# EAGLE design encoder (EAGLE 8.6.0)
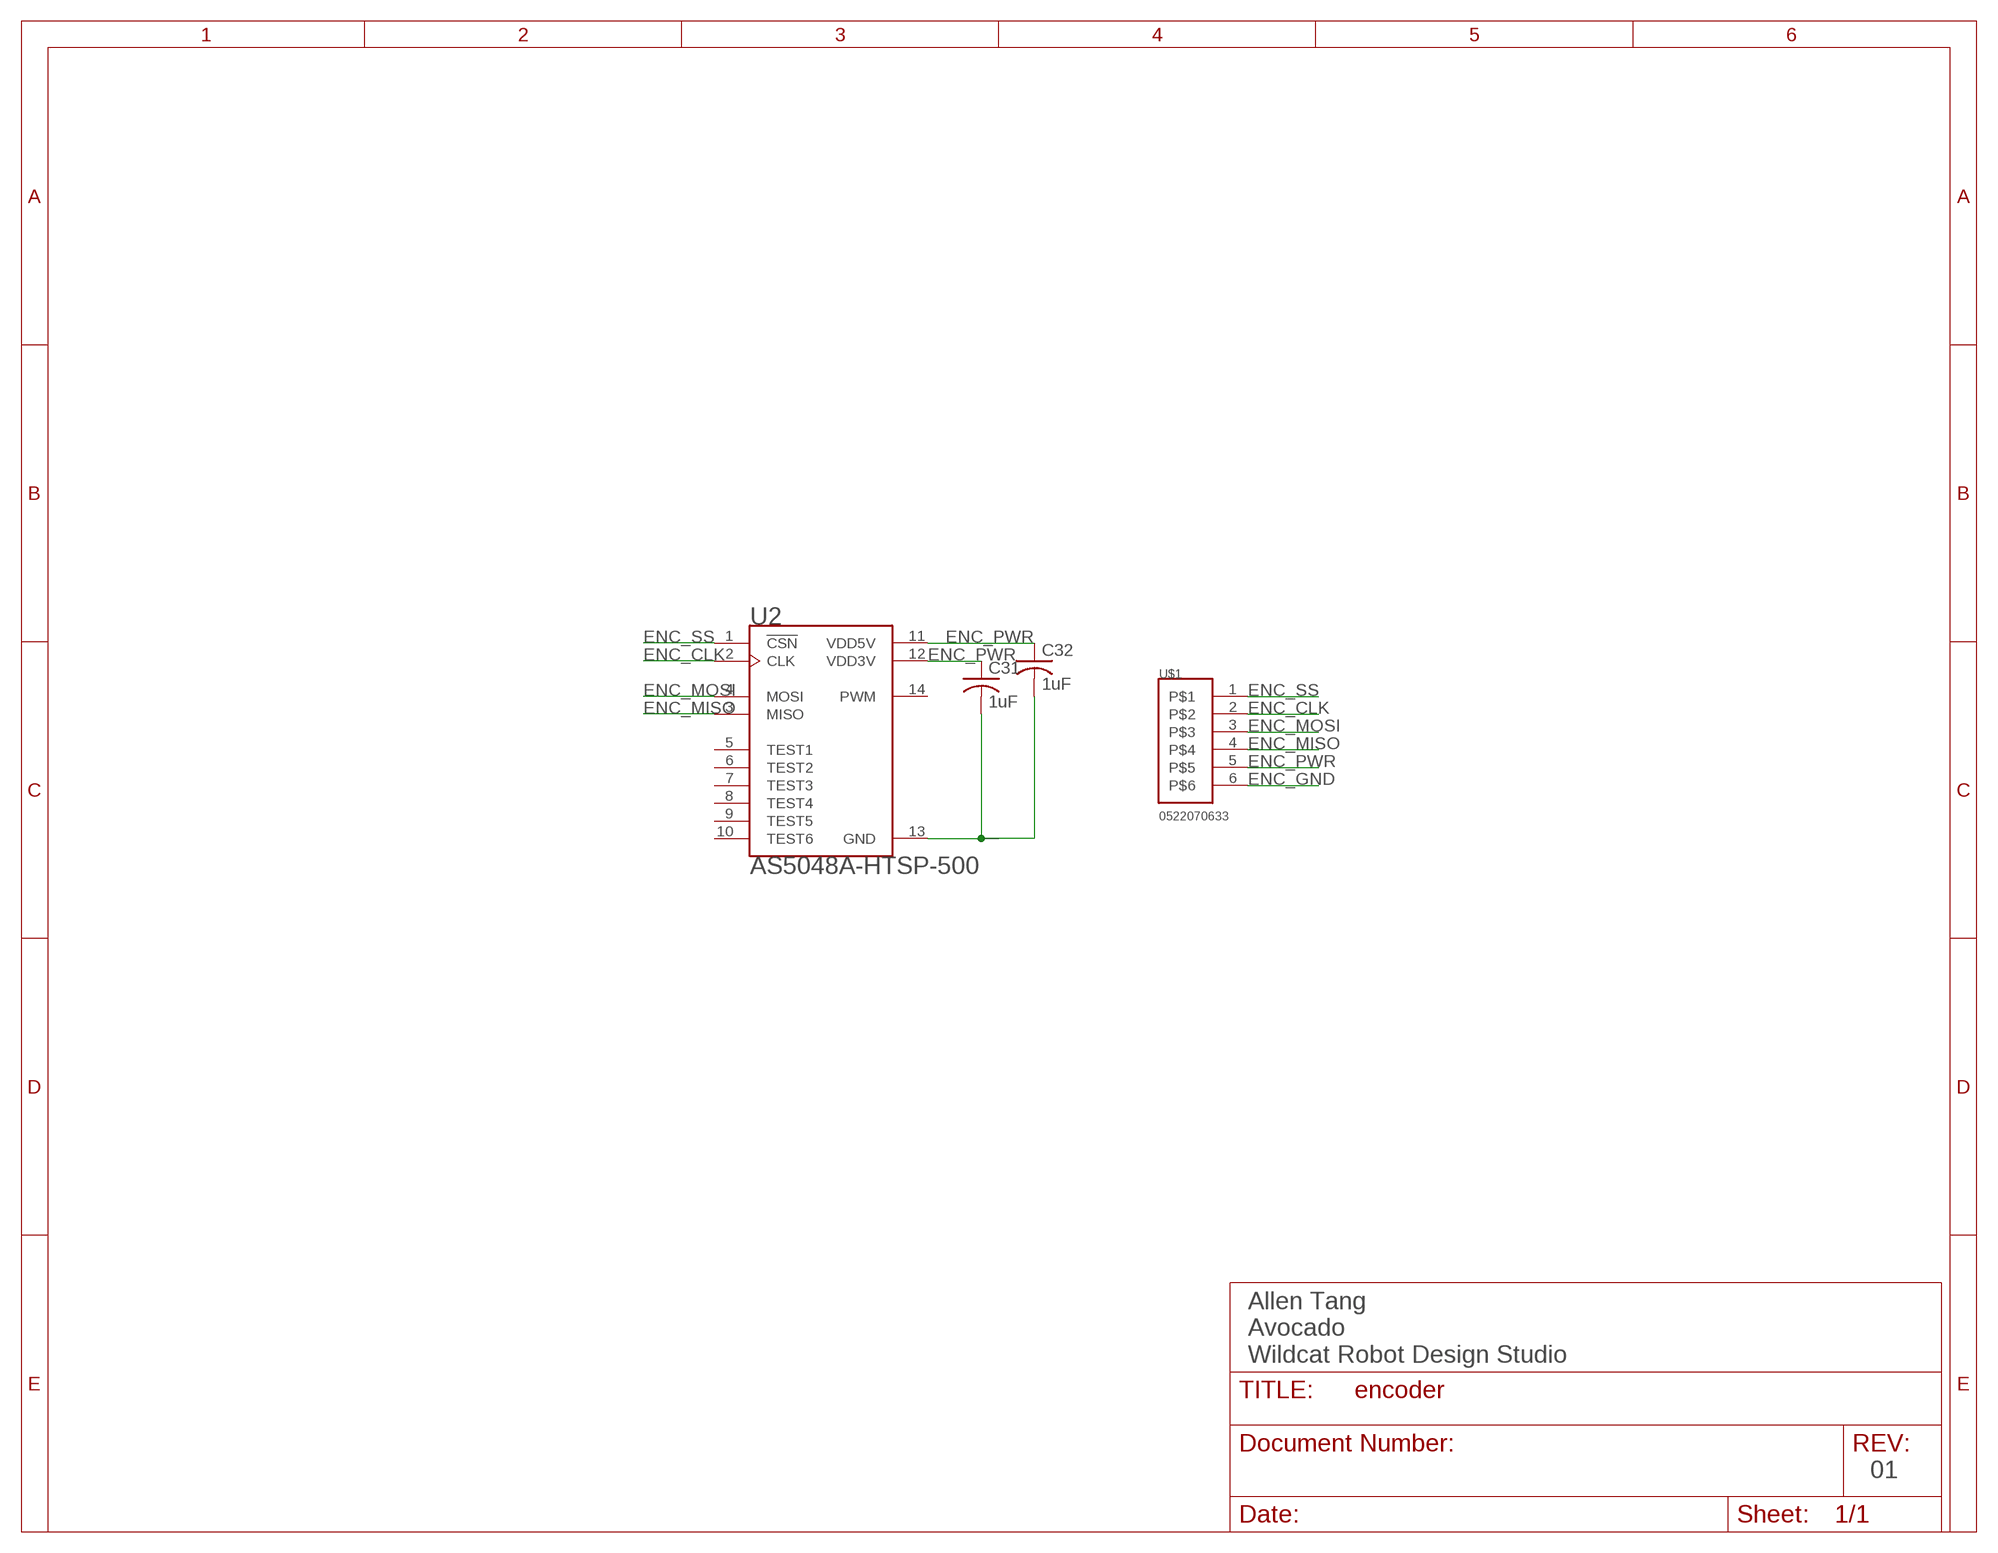
[diagram p0: schematic, sheet 1]

## Parts
C31  1uF  C-USC0805  [C0805]
C32  1uF  C-USC0805  [C0805]
U2  AS5048A-HTSP-500  [SOP65P640X120-14N]
U$1  0522070633  [1MM-FPC-6PIN]

## Nets
ENC_CLK: U2.2(CLK) U$1.2
ENC_GND: C31.2 C32.2 U2.13(GND) U$1.6
ENC_MISO: U2.3(MISO) U$1.4
ENC_MOSI: U2.4(MOSI) U$1.3
ENC_PWR: C31.1 C32.1 U2.11(VDD5V) U2.12(VDD3V) U$1.5
ENC_SS: U2.1(!CSN) U$1.1
Unconnected: U2.5(TEST1) U2.6(TEST2) U2.7(TEST3) U2.8(TEST4) U2.9(TEST5) U2.10(TEST6) U2.14(PWM)

## Notes on the sheet
- Allen Tang
  Avocado
  Wildcat Robot Design Studio
- 01

## Library data of the parts
C31 C32 = rcl:C-US: CAPACITOR, American symbol; SPICEPREFIX: C
U2 = avocado:AS5048A-HTSP-500: AS5048A Series 360° 3.3 / 5 V 14 bit Magnetic Rotary Encoder - TSSOP-14; AVAILABILITY: Unavailable; DESCRIPTION: AS5048B Series 360° 3.3 / 5 V 14 bit Magnetic Rotary Encoder - TSSOP-14; MF: ams; MP: AS5048A-HTSP-500; PACKAGE: TSSOP-14 ams; PRICE: 7.10 USD
U$1 = avocado:0522070633

## Board
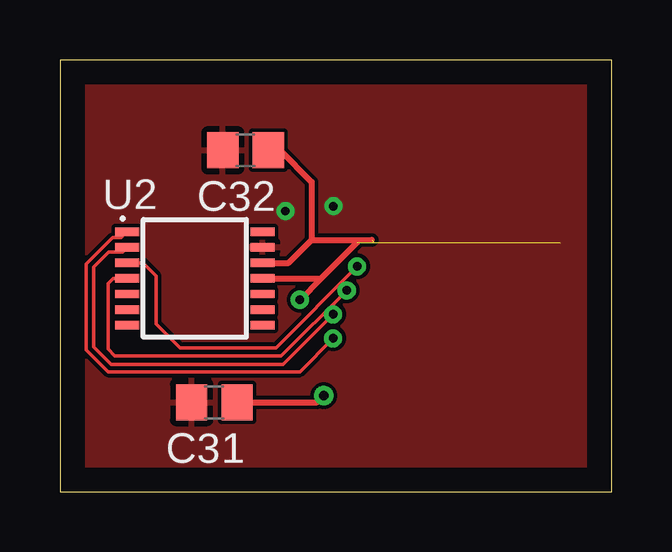
[diagram p1: board, top side]
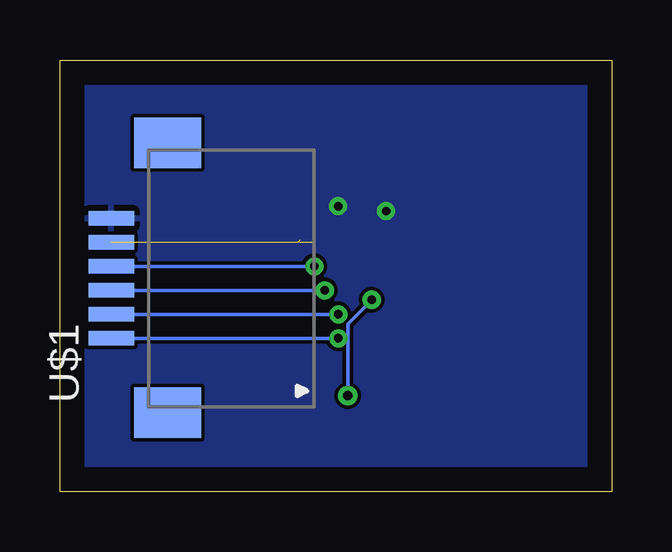
[diagram p2: board, bottom side, seen from below]

Size 23 x 18 mm. Coordinates in mm from the lower left corner, seen from the top.
Outline: 0,0 23,0 23,18 0,18 0,0
Copper layers (1*16): Top 0.035mm / dielectric 1.5mm / Bottom 0.035mm
Design rules "default": minimum track width 6mil, minimum drill 0.35mm, track to track 6mil, track to pad 6mil, pad to pad 6mil, via to via 6mil, smd to smd 6mil, copper to edge 40mil, drill to drill 6mil, minimum pad ring 10mil, minimum via ring 8mil, stop-mask expansion 4mil, vias tented up to drill 0mil, thermal gap 10mil

### Footprints (pad centres in the part's own frame; a part is rotated, then mirrored left to right if it is on the bottom)
C0805 = smd 1.3 x 1.5: 1 -0.95,0; 2 0.95,0
SOP65P640X120-14N = smd 1 x 0.35: 1 -2.825,1.95; 2 -2.825,1.3; 3 -2.825,0.65; 4 -2.825,0; 5 -2.825,-0.65; 6 -2.825,-1.3; 7 -2.825,-1.95; 8 2.825,-1.95; 9 2.825,-1.3; 10 2.825,-0.65; 11 2.825,0; 12 2.825,0.65; 13 2.825,1.3; 14 2.825,1.95
1MM-FPC-6PIN = smd 0.6 x 1.9: 1 -2.5,3.25; 2 -1.5,3.25; 3 -0.5,3.25; 4 0.5,3.25; 5 1.5,3.25; 6 2.5,3.25 | smd 2.1 x 2.8: THERMPAD 5.65,0.9; THERMPAD1 -5.6,0.9

### Placement (x,y rotation side)
C31  6.44,3.72 180 top
C32  7.74,14.23 180 top
U2  5.62,8.89 0 top
U$1  17.61,8.89 90 bottom

### Tracks (layer width: path | path; a pad name or v marks a point on that pad's centre or on a via)
ENC_CLK  (via drill 0.35)
  Top 0.152: v11.39,7.39 9.3,5.3 2.13,5.3 1.4,6.03 1.4,9.36 2.04,10 2.6,10 U2.2
  Bottom 0.152: U$1.2 v11.39,7.39
ENC_GND  (via drill 0.35)
  other vias: 9.4,11.7 11.4,11.9
  pour Top: -1.5,22.1 24,22 24,-4 -1.5,-3.9
  pour Bottom: -1.5,22 24,22 24,-4 -1.5,-4
ENC_MISO  (via drill 0.35)
  Top 0.152: U2.3 3.46,9.54 4,9 4,7 5,6 9,6 v12.39,9.39
  Bottom 0.152: U$1.4 v12.39,9.39
ENC_MOSI  (via drill 0.35)
  Top 0.152: U2.4 2.22,8.89 2,8.67 2,5.94 2.29,5.65 9.22,5.65 v11.96,8.39
  Bottom 0.152: v11.96,8.39 U$1.3
ENC_PWR  (via drill 0.35, 0.4)  (3 unrouted)
  Top 0.152: C32.1 9.17,14.23
  Top 0.254: U2.11 10.89,8.89 | 10.89,8.89 12.39,10.39 | U2.12 9.54,9.54 10.49,10.49 | v10,8 10.89,8.89 | C31.1 10.72,3.72 v11,4 | 10.49,10.49 10.49,12.91 9.17,14.23 | 10.49,10.49 13,10.49
  Bottom 0.152: v11,4 11,7 v10,8
ENC_SS  (via drill 0.35)
  Top 0.152: U2.1 2.55,10.59 2.2,10.59 1.09,9.48 1.09,5.91 2,5 10,5 v11.39,6.39
  Bottom 0.152: v11.39,6.39 U$1.1